# Altium schematic sheet URB2405YMD-10WR3_C41361045URB2405YMD-10WR3_C41361045.schdoc
size 127 x 101 mm
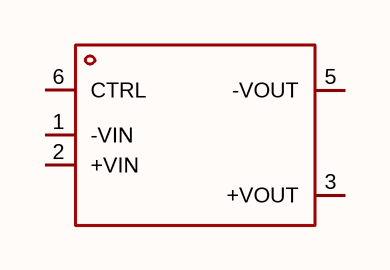
[diagram p0: URB2405YMD-10WR3_C41361045URB2405YMD-10WR3_C41361045.schdoc]

## Parts
U?  (no value)

## Nets

Not connected (* = marked no-connect by the designer): U? 1(-VIN) 2(+VIN) 3(+VOUT) 5(-VOUT) 6(CTRL)

## Library data of the parts
U? = URB2405YMD-10WR3_C41361045: Symbol: URB2405YMD-10WR3_C41361045